# Altium project Baby_Pukeko_FC.PrjPcb
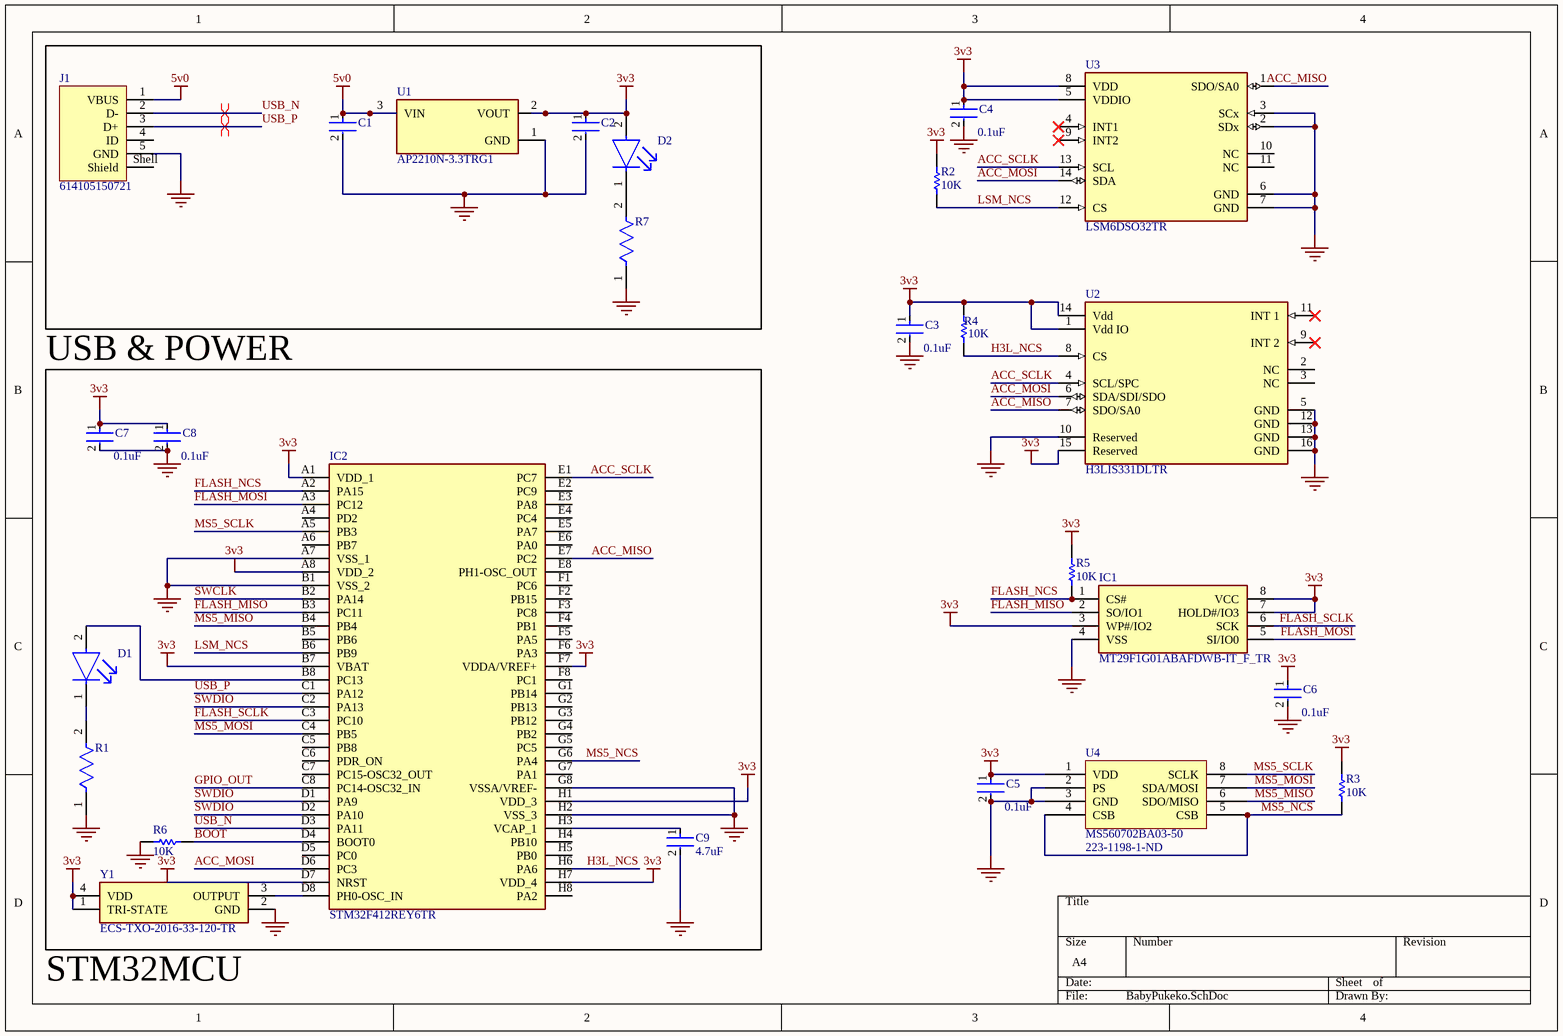
[diagram p0: BabyPukeko.SchDoc]
1 sheet, 26 parts. Net scope: global (net labels, ports and power ports of the same name join across sheets).
Board file: BabyPukeko.PcbDoc

## Sheet BabyPukeko.SchDoc
size A4; SheetNumber: 1; SheetTotal: 1

### Parts
C1  C0402C105K8PACTU  [FP-C0402C105K8PACTU-MFG]  (value not drawn)
C2  C0402C105K8PACTU  [FP-C0402C105K8PACTU-MFG]  (value not drawn)
C3  0.1uF  [FP-C0402-BB-MFG]
C4  0.1uF  [FP-C0402-BB-MFG]
C5  0.1uF  [FP-C0402-BB-MFG]
C6  0.1uF  [FP-C0402-BB-MFG]
C7  0.1uF  [FP-C0402-BB-MFG]
C8  0.1uF  [FP-C0402-BB-MFG]
C9  4.7uF  [FP-C1005-050-0_15-MFG]
D1  APHHS1005CGCK  [FP-APHHS1005CGCK-MFG]  (value not drawn)
D2  APHHS1005CGCK  [FP-APHHS1005CGCK-MFG]  (value not drawn)
IC1  MT29F1G01ABAFDWB-IT_F_TR  [SON127P800X600X65-8N]
IC2  STM32F412REY6TR  [BGA64C40P8X8_362X365X58]
J1  614105150721  [614105150721]
R1  RC0402FR-071KL  [FP-RC0402-0_4-IPC_A]  (value not drawn)
R2  10K  [RESC1005X40X25LL05T10]
R3  10K  [RESC1005X40X25LL05T10]
R4  10K  [RESC1005X40X25LL05T10]
R5  10K  [RESC1005X40X25LL05T10]
R6  10K  [RESC1005X40X25LL05T10]
R7  RC0402FR-071KL  [FP-RC0402-0_4-IPC_A]  (value not drawn)
U1  AP2210N-3.3TRG1  [FP-SOT23-IPC_C]
U2  H3LIS331DLTR  [FP-TFLGA16-7983231-MFG]
U3  LSM6DSO32TR  [FP-LGA-14L-DM00249496-MFG]
U4  MS560702BA03-50  Supplier Part Number 1: 223-1198-1-ND  [MS5607]
Y1  ECS-TXO-2016-33-120-TR  [ECSTXO201633120TR]

### Nets
3v3: C2.1 C3.1 C4.1 C5.1 C6.1 C7.1 C8.1 D2.2(A) IC1.3(WP#/IO2) IC1.7(HOLD#/IO3) IC1.8(VCC) IC2.A1(VDD_1) IC2.A8(VDD_2) IC2.B7(VBAT) IC2.D7(NRST) IC2.F7(VDDA/VREF+) IC2.H1(VDD_3) IC2.H7(VDD_4) R2.1 R3.1 R4.1 R5.1 U1.2(VOUT) U2.1(Vdd_IO) U2.14(Vdd) U2.15(Reserved) U3.5(VDDIO) U3.8(VDD) U4.1(VDD) Y1.1(TRI-STATE) Y1.4(VDD)
5v0: C1.1 J1.1(VBUS) U1.3(VIN)
GND: C1.2 C2.2 C3.2 C4.2 C5.2 C6.2 C7.2 C8.2 C9.2 IC1.4(VSS) IC2.A7(VSS_1) IC2.B1(VSS_2) IC2.G8(VSSA/VREF-) IC2.H2(VSS_3) J1.5(GND) R1.1 R6.1 R7.1 U1.1(GND) U2.5(GND) U2.10(Reserved) U2.12(GND) U2.13(GND) U2.16(GND) U3.2(SDx) U3.3(SCx) U3.6(GND) U3.7(GND) U4.2(PS) U4.3(GND) Y1.2(GND)
ACC_MISO: IC2.E7(PC2) U2.7(SDO/SA0) U3.1(SDO/SA0)
ACC_MOSI: IC2.D6(PC3) U2.6(SDA/SDI/SDO) U3.14(SDA)
ACC_SCLK: IC2.E1(PC7) U2.4(SCL/SPC) U3.13(SCL)
BOOT: IC2.D4(BOOT0) R6.2
FLASH_MISO: IC1.2(SO/IO1) IC2.B3(PC11)
FLASH_MOSI: IC1.5(SI/IO0) IC2.A3(PC12)
FLASH_NCS: IC1.1(CS#) IC2.A2(PA15) R5.2
FLASH_SCLK: IC1.6(SCK) IC2.C3(PC10)
GPIO_OUT: IC2.C8(PC14-OSC32_IN)
H3L_NCS: IC2.H6(PA6) R4.2 U2.8(CS)
LSM_NCS: IC2.B6(PB9) R2.2 U3.12(CS)
MS5_MISO: IC2.B4(PB4) U4.6(SDO/MISO)
MS5_MOSI: IC2.C4(PB5) U4.7(SDA/MOSI)
MS5_NCS: IC2.G6(PA4) R3.2 U4.4(CSB) U4.5(CSB)
MS5_SCLK: IC2.A5(PB3) U4.8(SCLK)
SWCLK: IC2.B2(PA14)
SWDIO: IC2.C2(PA13) IC2.D1(PA9) IC2.D2(PA10)
USB_N: IC2.D3(PA11) J1.2(D-)
USB_P: IC2.C1(PA12) J1.3(D+)
NetC9_1: C9.1 IC2.H3(VCAP_1)
NetD1_1: D1.1(C) R1.2
NetD1_2: D1.2(A) IC2.B8(PC13)
NetD2_1: D2.1(C) R7.2
NetIC2_D8: IC2.D8(PH0-OSC_IN) Y1.3(OUTPUT)

Not connected (* = marked no-connect by the designer): IC2 A4(PD2) A6(PB7) B5(PB6) C5(PB8) C6(PDR_ON) C7(PC15-OSC32_OUT) D5(PC0) E2(PC9) E3(PA8) E4(PC4) E5(PA7) E6(PA0) E8(PH1-OSC_OUT) F1(PC6) F2(PB15) F3(PC8) F4(PB1) F5(PA5) F6(PA3) F8(PC1) G1(PB14) G2(PB13) G3(PB12) G4(PB2) G5(PC5) G7(PA1) H4(PB10) H5(PB0) H8(PA2); J1 4(ID) Shell(Shield); U2 2(NC) 3(NC) 9(INT_2)* 11(INT_1)*; U3 4(INT1)* 9(INT2)* 10(NC) 11(NC)

### Layout directives
differential pair: USB_N, USB_P

### Notes on the sheet
- USB & POWER
- (near Y1) STM32MCU

### Library data of the parts
C1 C2 = CMP-2008-02081-2: CAP CER 1UF 10V X5R 0402; Dielectric Material: Ceramic; Dissipation Factor: 5%; Tolerance: 10%; Number of Pins: 2; Contact Plating: Tin; Min Operating Temperature: -55°C; Termination: SMD/SMT; Lead Free: Lead Free; Construction: Flat; Voltage Rating (DC): 10V; Mount: Surface Mount; Series: C; Thickness: 0.022inch; Width: 0.5mm; Radiation Hardening: No; Capacitance: 1uF; Dielectric: X5R; Height: 0.5mm; Voltage: 10V; Length: 1mm; Depth: 0.5mm; Max Operating Temperature: 85°C; Package Quantity: 1; Packaging: Tape and Reel; RoHS Compliant: Yes; Case Code (Imperial): 0402; Case Code (Metric): 1005; REACH SVHC: No SVHC; Voltage Rating: 10V; Case/Package: 0402
C3-C8 = CMP-2008-02046-2: CAP CER 0.1UF 10V X5R 0402; Manufacturer: Kemet; Manufacturer Part Number: C0402C104K8PACTU; Material: Ceramic; Capacitance: 0.10 μF; Temperature Coefficient: 15%; Tolerance: 0.1; Value: 0.10 μF; Package: C0402-BB; Temperature: -55°C to +125°C; ComponentLink2Description: Datasheet; Temperature Characteristic: X5R; Device Class L1: Passive Components; Height: 0.55mm; Lead Free: Yes; ComponentLink2URL: https://content.kemet.com/datasheets/KEM_C1002_X7R_SMD.pdf; Device Class L2: Capacitors; Temperature Range Low: -55°C; Temperature Range High: +125°C; RoHS: TRUE; Octopart: https://octopart.com/c0402c104k8pactu-kemet-140039; Automotive: No; Mouser Description: Capacitor 100 nF 10 VDC 0402; Category: Cap; Voltage Rating: 10 V; Digikey Description: CAP CER 0.1UF 10V X5R 0402; Ipc Land Pattern Name: CAPC10050X50; Device Class L3: Ceramic Capacitors
C9 = CMP-2000-05997-2: CAP CER 4.7UF 10V X5R 0402; Dielectric Material: Ceramic; Tolerance: 10%; Series: C; Package Quantity: 10000; Max Operating Temperature: 85°C; Case Code (Imperial): 0402; Lead Free: Lead Free; Voltage Rating (DC): 10V; Packaging: Cut Tape; Voltage Rating: 10V; Min Operating Temperature: -55°C; Dielectric: X5R; Thickness: 0.022inch; Width: 0.02inch; Case/Package: 0402; Case Code (Metric): 1005; Capacitance: 4.7uF; Length: 0.039inch; RoHS Compliant: Yes; REACH SVHC: No SVHC; Mount: Surface Mount
D1 D2 = CMP-44529-000044-1: LED GREEN CLEAR CHIP SMD; Viewing Angle: 120°; Dominant Wavelength: 570nm; Test Current: 20mA; Luminous Intensity: 50mcd; Forward Voltage: 2.1V; Number of LEDs: 1; Lens Color: Clear; Packaging: Tape and Reel; Max Operating Temperature: 85°C; Illumination Color: Green; Length: 1mm; Mount: Surface Mount; Lens Style: Clear; Color: Green; Number of Pins: 2; Wavelength: 570nm; Case/Package: 0402; Width: 0.5mm; Package Quantity: 2000; Case Code (Metric): 1005; Height: 0.6mm; Lead Free: Lead Free; Case Code (Imperial): 0402; Forward Current: 20mA; Min Operating Temperature: -40°C
IC1 = MT29F1G01ABAFDWB-IT_F_TR: Integrated Circuit; Manufacturer_Name: Micron; Manufacturer_Part_Number: MT29F1G01ABAFDWB-IT:F TR; Datasheet Link: https://static6.arrow.com/aropdfconversion/e214d87b5f763ef07ebe46ce1e43d78d0de80c6/m78a_1gb_3v_nand_spi.pdf; Height: 0.65mm; Mouser Part Number: 340-319941-REEL; Mouser Price/Stock: https://www.mouser.co.uk/ProductDetail/Micron/MT29F1G01ABAFDWB-ITF-TR?qs=j%252B1pi9TdxUZK8%252B7736rAcg%3D%3D; Arrow Part Number: MT29F1G01ABAFDWB-IT:F TR; Arrow Price/Stock: https://www.arrow.com/en/products/mt29f1g01abafdwb-itf-tr/micron-technology
IC2 = STM32F412REY6TR: Integrated Circuit; Manufacturer_Name: STMicroelectronics; Datasheet Link: http://www.st.com/content/ccc/resource/technical/document/datasheet/15/90/07/b3/8c/10/4e/95/DM00213872.pdf/files/DM00213872.pdf/jcr:content/translations/en.DM00213872.pdf; Height: 0.585mm; Manufacturer_Part_Number: STM32F412REY6TR; Mouser Part Number: 511-STM32F412REY6TR; Mouser Price/Stock: https://www.mouser.co.uk/ProductDetail/STMicroelectronics/STM32F412REY6TR?qs=qzCNEk%252BRr%252BY9qzpOClZyHQ%3D%3D; Arrow Part Number: STM32F412REY6TR; Arrow Price/Stock: https://www.arrow.com/en/products/stm32f412rey6tr/stmicroelectronics?region=nac
J1 = CMP-1502-03250-2: NexarPartId: 52645111; USB Standard: USB 2.0; Current Rating: 1.8A; Connector Type: USB; Operating Supply Voltage: 30V; Gender: Receptacle; Number of Contacts: 5; Contact Resistance: 30mΩ; Insulation Resistance: 1GΩ; Height: 5.81mm; RoHS: Compliant; Packaging: Tape and Reel; Number of Pins: 5; Orientation: Vertical; Max Operating Temperature: 85°C; Min Operating Temperature: -40°C; Contact Plating: Gold; Contact Material: Gold; Voltage Rating: 30V; Mount: Through Hole, Vertical; REACH SVHC: Unknown; Features: Shielded; Lead Free: Lead Free
R1 R7 = CMP-2002-07472-3: RES 1K OHM 1% 1/16W 0402; Max Power Dissipation: 63mW; Resistance: 1kR; Voltage Rating (DC): 50V; Temperature Coefficient: 100ppm/°C; Power Rating: 62.5mW; Technology: THICK FILM; Size Code: 0402; Series: RC; Length: 1mm; Case/Package: 0402; Features: Moisture Resistant; Termination: SMD/SMT; Case Code (Metric): 1005; Reach SVHC Compliant: Yes; Number of Terminations: 2; Tolerance: 1%; Lead Free: Lead Free; Military Standard: Not; Resistor Type: Thick Film; Max Operating Temperature: 155°C; RoHS Compliant: Yes; Construction: Rectangular; Voltage Rating: 50V; Packaging: Tape and Reel; Height: 0.32mm; Number of Pins: 2; Resistance Tolerance: 1%; Case Code (Imperial): 0402; Depth: 0.5mm; Min Operating Temperature: -55°C; Width: 0.5mm
R2-R6 = CMP-2002-07353-1: Part Number: RC0402FR-0710KL; Manufacturer: Yageo / Phycomp
U1 = CMP-12756-000036-1: IC REG LINEAR 3.3V 300MA SOT23-3; Accuracy: 1%; Max Input Voltage: 13.2V; Number of Outputs: 1; Polarity: Positive; Power Supply Rejection Ratio (PSRR): 75dB; Quiescent Current: 150uA; Min Input Voltage: 2.5V; Output Type: Fixed; Dropout Voltage: 250mV; Height: 1.3mm; Weight: 0.000282oz; Packaging: Tape and Reel; Length: 3.02mm; Width: 1.7mm; Max Operating Temperature: 125°C; Output Voltage: 3.3V; Min Operating Temperature: -40°C; Output Current: 300mA; Number of Pins: 3; Number of Regulators: 1; Max Output Current: 300mA; Mount: Surface Mount; Case/Package: SOT-23-3; Package Quantity: 3000
U2 = CMP-12175-000002-1: ACCEL 100-400G I2C/SPI 16TFLGA; Manufacturer: STMicroelectronics; Min Supply Voltage: 2.16V; Accel Axis: X+Y and Z; Sensor Output: I2C,SPI; Accel Resolution: 16bits; Operating Supply Current: 10-300uA; Accel Range: 100/200/400g; Max Supply Voltage: 3.6V; Temperature: -40°C to +85°C; Octopart: https://octopart.com/h3lis331dltr-stmicroelectronics-29186499; Automotive: No; Digikey Description: ACCEL 100-400G I2C/SPI 16TFLGA; Device Class L3: Accelerometers; ComponentLink2URL: https://www.st.com/resource/en/datasheet/h3lis331dl.pdf; Device Class L2: Motion Sensors; Package: TFLGA16-7983231; Mouser Description: Accelerometer Triple +/-100g/+/-200g/+/-400g 2.5V 16-Pin TFLGA T/R; ComponentLink2Description: Datasheet; Device Class L1: Sensors; Lead Free: Yes; RoHS: TRUE; Footprint Url: https://www.st.com/content/ccc/resource/technical/document/technical_note/73/17/9c/16/dd/96/4a/01/CD00134799.pdf/files/CD00134799.pdf/jcr:content/translations/en.CD00134799.pdf; Height: 1mm; Category: IC; Manufacturer Part Number: H3LIS331DLTR; Temperature Range Low: -40°C; Temperature Range High: +85°C
U3 = CMP-12177-000015-1: INEMO INERTIAL MODULE: 3D ACCELE
U4 = CMP-040-000016-3: Barometric Pressure Sensor I2C/SPI; Reviewed By: Adam Rising; Made By: *; Supplier 1: Digi-Key; Design Item ID: MS560702BA03-50; Source: Sensors.SchLib
Y1 = ECS-TXO-2016-33-120-TR: Crystal or Oscillator; Manufacturer_Name: ECS; Datasheet Link: https://ecsxtal.com/store/pdf/ECS-TXO-2016.pdf; Height: 0.8mm; Manufacturer_Part_Number: ECS-TXO-2016-33-120-TR; Mouser Part Number: 520-TXO-2016-33-120T; Mouser Price/Stock: https://www.mouser.co.uk/ProductDetail/ECS/ECS-TXO-2016-33-120-TR?qs=PzGy0jfpSMsr8Aj1SRFQrg%3D%3D; Arrow Part Number: ECS-TXO-2016-33-120-TR; Arrow Price/Stock: https://www.arrow.com/en/products/ecs-txo-2016-33-120-tr/ecs-international?region=nac